# Altium schematic sheet PowCarbinBoard_Power.SchDoc
size A3
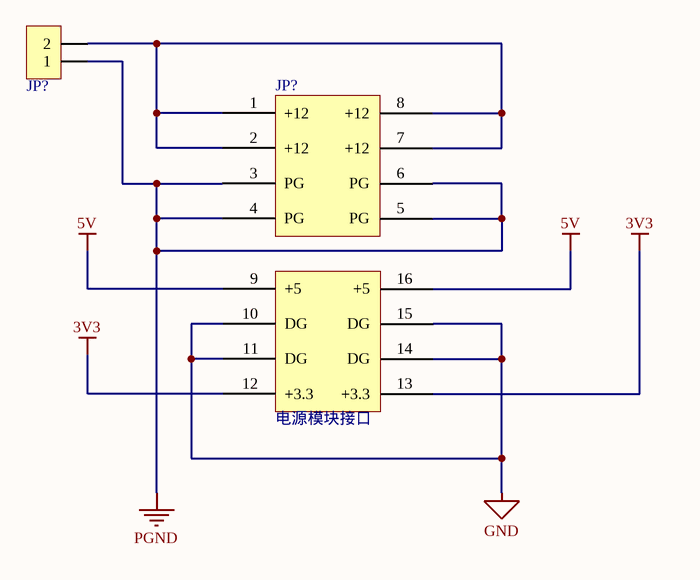
[diagram p0: PowCarbinBoard_Power.SchDoc]

## Parts
(Parts that share a designator on the sheet are numbered #1, #2 ... from top to bottom, then left to right.)
JP?#1  HDR-1X2  [KF128-5.08-2P]  (value not drawn)
JP?#2  电源模块接口  [排针-座 2*4]

## Nets
3V3: JP?#2.12(+3.3) JP?#2.13(+3.3)
5V: JP?#2.9(+5) JP?#2.16(+5)
GND: JP?#2.10(DG) JP?#2.11(DG) JP?#2.14(DG) JP?#2.15(DG)
PGND: JP?#1.1 JP?#2.3(PG) JP?#2.4(PG) JP?#2.5(PG) JP?#2.6(PG)
NetJP?#1_2: JP?#1.2 JP?#2.1(+12) JP?#2.2(+12) JP?#2.7(+12) JP?#2.8(+12)

## Library data of the parts
JP?#1 = Header 2: 2P接插件; 版权归属: 源创客; BOM名称: 2P接插件; 学习资源: www.ooocke.com